# EAGLE design Mainsnode_v2_openmote (EAGLE 6.3)
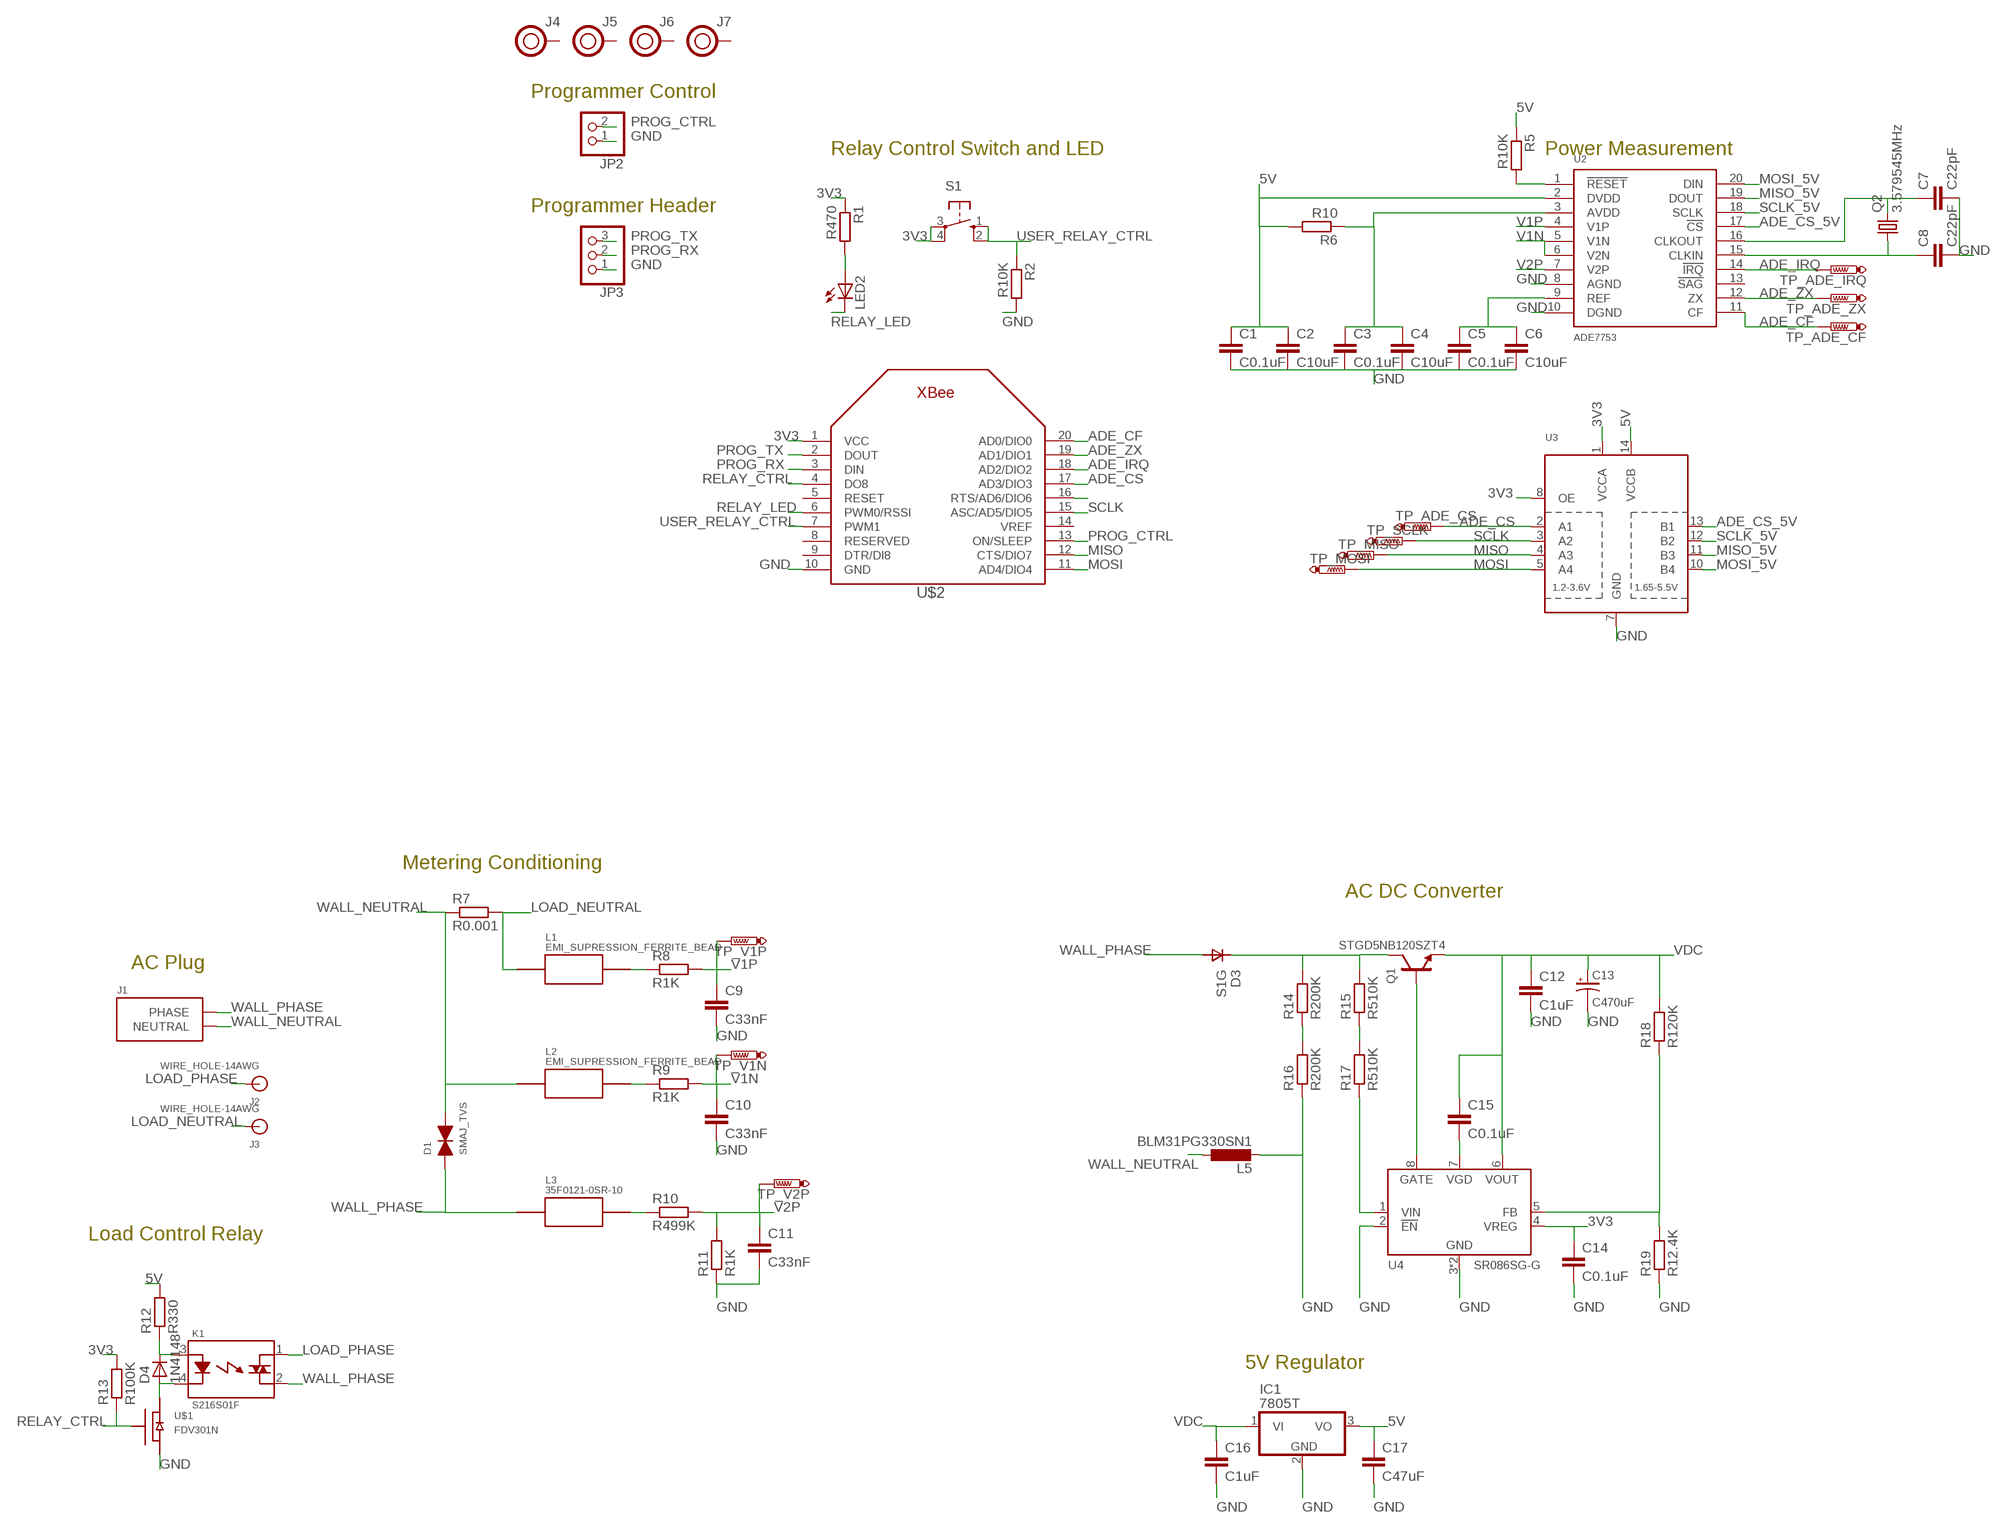
[diagram p0: schematic, sheet 1]

## Parts
C1  C0.1uF  C-EUC0805  [C0805]
C2  C10uF  C-EUC0805  [C0805]
C3  C0.1uF  C-EUC0805  [C0805]
C4  C10uF  C-EUC0805  [C0805]
C5  C0.1uF  C-EUC0805  [C0805]
C6  C10uF  C-EUC0805  [C0805]
C7  C22pF  C-EUC0805  [C0805]
C8  C22pF  C-EUC0805  [C0805]
C9  C33nF  C-EUC0805  [C0805]
C10  C33nF  C-EUC0805  [C0805]
C11  C33nF  C-EUC0805  [C0805]
C12  C1uF  C-EUC0805  [C0805]
C13  C470uF  CAP_EEE-FP1E471AP  [CAP_SM_10MM]
C14  C0.1uF  C-EUC0805  [C0805]
C15  C0.1uF  C-EUC0805  [C0805]
C16  C1uF  C-EUC0805  [C0805]
C17  C47uF  C-EUC0805  [C0805]
D1  SMAJ_TVS  [DO214_TVS]
D3  S1G  [DO-214AC]
D4  1N4148  D-SOD-80  [SOD80]
IC1  7805T  [TO220H]
J1  AC-PLUG-2  [AC_MALE_PINS_2]
J2  WIRE_HOLE-14AWG  [WIRE_HOLE-14AWG]
J3  WIRE_HOLE-14AWG  [WIRE_HOLE-14AWG]
J4  HOLE  [HOLE-0.125]
J5  HOLE  [HOLE-0.125]
J6  HOLE  [HOLE-0.125]
J7  HOLE  [HOLE-0.125]
JP2  PINHD-1X2  [1X02]
JP3  PINHD-1X3  [1X03]
K1  S216S01F  [RELAY_SX16S0X]
L1  EMI_SUPRESSION_FERRITE_BEAD  [L1806]
L2  EMI_SUPRESSION_FERRITE_BEAD  [L1806]
L3  35F0121-0SR-10  [35F0102]
L5  BLM31PG330SN1  L-EUL3216C  [L3216C]
LED2  LED3MM  [LED3MM]
Q1  STGD5NB120SZT4  [DPAK]
Q2  3.579545MHz  CRYSTALHC49S  [HC49/S]
R1  R470  R-EU_R0805  [R0805]
R2  R10K  R-EU_R0805  [R0805]
R5  R10K  R-EU_R0805  [R0805]
R6  R10  R-EU_R0805  [R0805]
R7  R0.001  R-EU_R2512  [R2512]
R8  R1K  R-EU_R0805  [R0805]
R9  R1K  R-EU_R0805  [R0805]
R10  R499K  R-EU_R0805  [R0805]
R11  R1K  R-EU_R0805  [R0805]
R12  R330  R-EU_R0805  [R0805]
R13  R100K  R-EU_R0805  [R0805]
R14  R200K  R-EU_R0805  [R0805]
R15  R510K  R-EU_R0805  [R0805]
R16  R200K  R-EU_R0805  [R0805]
R17  R510K  R-EU_R0805  [R0805]
R18  R120K  R-EU_R0805  [R0805]
R19  R12.4K  R-EU_R0805  [R0805]
S1  10-XX  [B3F-10XX]
TP_ADE_CF  PTR1PAD1-13  [P1-13]
TP_ADE_CS  PTR1PAD1-13  [P1-13]
TP_ADE_IRQ  PTR1PAD1-13  [P1-13]
TP_ADE_ZX  PTR1PAD1-13  [P1-13]
TP_MISO  PTR1PAD1-13  [P1-13]
TP_MOSI  PTR1PAD1-13  [P1-13]
TP_SCLK  PTR1PAD1-13  [P1-13]
TP_V1N  PTR1PAD1-13  [P1-13]
TP_V1P  PTR1PAD1-13  [P1-13]
TP_V2P  PTR1PAD1-13  [P1-13]
U2  ADE7753  [SSOP-20]
U3  TXB0104PWR  [TSSOP14]
U4  SR086SG-G  [SR086]
U$1  FDV301N  [SOT-23]
U$2  XBEE  [XBEE]

## Nets
3V3: C14.1 R1.1 R13.2 S1.3(P) S1.4(P1) U3.1(VCCA) U3.8(OE) U4.4(VREG) U$2.1(VCC)
5V: C1.1 C2.1 C17.1 IC1.3(VO) R5.1 R6.2 R12.2 U2.2(DVDD) U3.14(VCCB)
ADE_CF: TP_ADE_CF.TP U2.11(CF) U$2.20(AD0/DIO0)
ADE_CS: TP_ADE_CS.TP U3.2(A1) U$2.17(AD3/DIO3)
ADE_CS_5V: U2.17(!CS) U3.13(B1)
ADE_IRQ: TP_ADE_IRQ.TP U2.14(!IRQ) U$2.18(AD2/DIO2)
ADE_ZX: TP_ADE_ZX.TP U2.12(ZX) U$2.19(AD1/DIO1)
GND: C1.2 C2.2 C3.2 C4.2 C5.2 C6.2 C7.2 C8.2 C9.2 C10.2 C11.2 C12.2 C13.- C14.2 C16.2 C17.2 IC1.2(GND) JP2.1 JP3.1 L5.2 R2.2 R11.1 R16.1 R19.1 U2.8(AGND) U2.10(DGND) U3.7(GND) U4.2(!EN) U4.3(GND) U4.PAD(GND) U$1.2(S) U$2.10(GND)
LOAD_NEUTRAL: J3.P$1 L1.P$1 R7.2
LOAD_PHASE: J2.P$1 K1.1
MISO: TP_MISO.TP U3.4(A3) U$2.12(CTS/DIO7)
MISO_5V: U2.19(DOUT) U3.11(B3)
MOSI: TP_MOSI.TP U3.5(A4) U$2.11(AD4/DIO4)
MOSI_5V: U2.20(DIN) U3.10(B4)
N$1: D4.1(C) K1.3 R12.1
N$2: LED2.A R1.2
N$3: D4.2(A) K1.4 U$1.3(D)
N$4: R5.2 U2.1(!RESET)
N$5: C3.1 C4.1 R6.1 U2.3(AVDD)
N$7: L1.P$2 R8.1
N$8: L2.P$2 R9.1
N$9: L3.2 R10.1
N$10: C5.1 C6.1 U2.9(REF)
N$13: D3.CATHODE Q1.P$2(C) R14.2 R15.2
N$14: R14.1 R16.2
N$15: R15.1 R17.2
N$17: R17.1 U4.1(VIN)
N$18: Q1.P$1(G) U4.8(GATE)
N$19: C7.1 Q2.2 U2.16(CLKOUT)
N$20: C8.1 Q2.1 U2.15(CLKIN)
N$21: C15.2 U4.7(VGD)
N$23: R18.1 R19.2 U4.5(FB)
N$26: U$2.16(RTS/AD6/DIO6)
PROG_CTRL: JP2.2 U$2.13(ON/SLEEP)
PROG_RX: JP3.2 U$2.3(DIN)
PROG_TX: JP3.3 U$2.2(DOUT)
RELAY_CTRL: R13.1 U$1.1(G) U$2.4(DO8)
RELAY_LED: LED2.K(C) U$2.6(PWM0/RSSI)
SCLK: TP_SCLK.TP U3.3(A2) U$2.15(ASC/AD5/DIO5)
SCLK_5V: U2.18(SCLK) U3.12(B2)
USER_RELAY_CTRL: R2.1 S1.1(S) S1.2(S1) U$2.7(PWM1)
V1N: C10.1 R9.2 TP_V1N.TP U2.5(V1N) U2.6(V2N)
V1P: C9.1 R8.2 TP_V1P.TP U2.4(V1P)
V2P: C11.1 R10.2 R11.2 TP_V2P.TP U2.7(V2P)
VDC: C12.1 C13.+ C15.1 C16.1 IC1.1(VI) Q1.P$3(E) R18.2 U4.6(VOUT)
WALL_NEUTRAL: D1.CATHODE J1.NEUTRAL1(NEUTRAL) J1.NEUTRAL2(NEUTRAL) L2.P$1 L5.1 R7.1
WALL_PHASE: D1.ANODE D3.ANNODE J1.PHASE1(PHASE) J1.PHASE2(PHASE) K1.2 L3.1
Unconnected: J4.1 J5.1 J6.1 J7.1 U2.13(!SAG) U$2.5(RESET) U$2.8(RESERVED) U$2.9(DTR/DI8) U$2.14(VREF)

## Notes on the sheet
- Programmer Control
- Relay Control Switch and LED | Power Measurement
- Programmer Header
- Metering Conditioning
- AC DC Converter
- AC Plug
- Load Control Relay
- 5V Regulator

## Library data of the parts
C1-C12 C14-C17 = resistor:C-EU: CAPACITOR, European symbol
C13 = powercube:CAP_EEE-FP1E471AP: Surface mount low ESR cap.; DIGIKEY: PCE4440CT-ND
D1 = powercube:SMAJ_TVS; DIGIKEY: SMAJ250CALFCT-ND
D3 = powercube:S1G: Diode 400V 1A SMA; DIGIKEY: S1GFSCT-ND
D4 = semicon-smd-ipc:D-: DIODE unfilled
IC1 = adafruit:78*: Positive VOLTAGE REGULATOR Added bigger pads to the TO-92 package
J1 = powercube:AC-PLUG-2: For use with Bud Industries Box: 377-1709-ND
J2 J3 = powercube:WIRE_HOLE-14AWG: Solder point for 14AWG wire
J4-J7 = powercube:HOLE: 0.125" PCB Hole with ring
JP2 = pinhead:PINHD-1X2: PIN HEADER
JP3 = pinhead:PINHD-1X3: PIN HEADER
K1 = powercube:S216S01F: RELAY SSR 240VAC 16A TRIAC 4-SIP; DIGIKEY: 425-2413-5-ND; MOUSER: 852-S216S01F; NEWARK: 14N9591
L1 L2 = powercube:EMI_SUPRESSION_FERRITE_BEAD: FERRITE 300MA 150 OHM 1806 SMD; DIGIKEY: 240-2418-1-ND
L3 = powercube:35F0121-0SR-10: FERRITE 10A 42 OHMS @ 10 MHZ SMD; DIGIKEY: 240-2520-1-ND
L5 = resistor:L-EU: INDUCTOR, European symbol
LED2 = adafruit:LED: LED OSRAM: - CHIPLED LG R971, LG N971, LY N971, LG Q971, LY Q971, LO R971, LY R971 LH N974, LH R974 LS Q976, LO Q976, LY Q976 LO Q996 - Hyper CHIPLED LW Q18S LB Q993, LB Q99A, LB R99A - SideLED LS A670, LO A670, LY A670, LG A670, LP A670 LB A673, LV A673, LT A673, LW A673 LH A674 LY A675 LS A676, LA A676, LO A676, LY A676, LW A676 LS A679, LY A679, LG A679 - Hyper Micro SIDELED® LS Y876, LA Y876, LO Y876, LY Y876 LT Y87S - SmartLED LW L88C, LW L88S LB L89C, LB L89S, LG L890 LS L89K, LO L89K, LY L89K LS L896, LA L896, LO L896, LY L896 - TOPLED LS T670, LO T670, LY T670, LG T670, LP T670 LSG T670, LSP T670, LSY T670, LOP T670, LYG T670 LG T671, LOG T671, LSG T671 LB T673, LV T673, LT T673, LW T673 LH T674 LS T676, LA T676, LO T676, LY T676, LB T676, LH T676, LSB T676, LW T676 LB T67C, LV T67C, LT T67C, LS T67K, LO T67K, LY T67K, LW E67C LS E67B, LA E67B, LO E67B, LY E67B, LB E67C, LV E67C, LT E67C LW T67C LS T679, LY T679, LG T679 LS T770, LO T770, LY T770, LG T770, LP T770 LB T773, LV T773, LT T773, LW T773 LH T774 LS E675, LA E675, LY E675, LS T675 LS T776, LA T776, LO T776, LY T776, LB T776 LHGB T686 LT T68C, LB T68C - Hyper Mini TOPLED® LB M676 - Mini TOPLED Santana® LG M470 LS M47K, LO M47K, LY M47K Source: http://www.osram.convergy.de/
Q1 = powercube:STGD5NB120SZ: 5 A - 1200 V - low drop internally clamped IGBT; DIGIKEY: 497-4352-1-ND
Q2 = crystal:CRYSTAL: CRYSTAL; OC_FARNELL: 1667008; OC_NEWARK: unknown
R1 R2 R5-R19 = resistor:R-EU_: RESISTOR, European symbol
S1 = switch-omron:10-XX: OMRON SWITCH; MPN: B3F-1000; OC_FARNELL: 176432; OC_NEWARK: 36M3542
TP_ADE_CF TP_ADE_CS TP_ADE_IRQ TP_ADE_ZX TP_MISO TP_MOSI TP_SCLK TP_V1N TP_V1P TP_V2P = testpad:PTR1: TEST PIN
U2 = powercube:ADE7753: Single-Phase Multifunction Metering IC; DIGIKEY: ADE7753ARSZRLCT-ND; MOUSER: 584-ADE7753ARSZR; NEWARK: 59K0984
U3 = adafruit:TXB0104PWR: 4-Bit Bi-Directional Level Shifter 1.2V-3.6V (VCCA) to 1.65V-5.5V (VCCB) bi-directional level shifter with auto direction sensing. Max data rate - VCCA 1.8V: 20Mbps (50ns), VCCA 3.3V: 100Mbps (10ns) Digikey: 296-21929-1-ND
U4 = powercube:SR086: Adjustable Off-Line Inductorless Switching Regulator; MOUSER: 689-SR086SG-G
U$1 = powercube:FDV301N; DIGIKEY: FDV301NCT-ND
U$2 = adafruit:XBEE

## Board
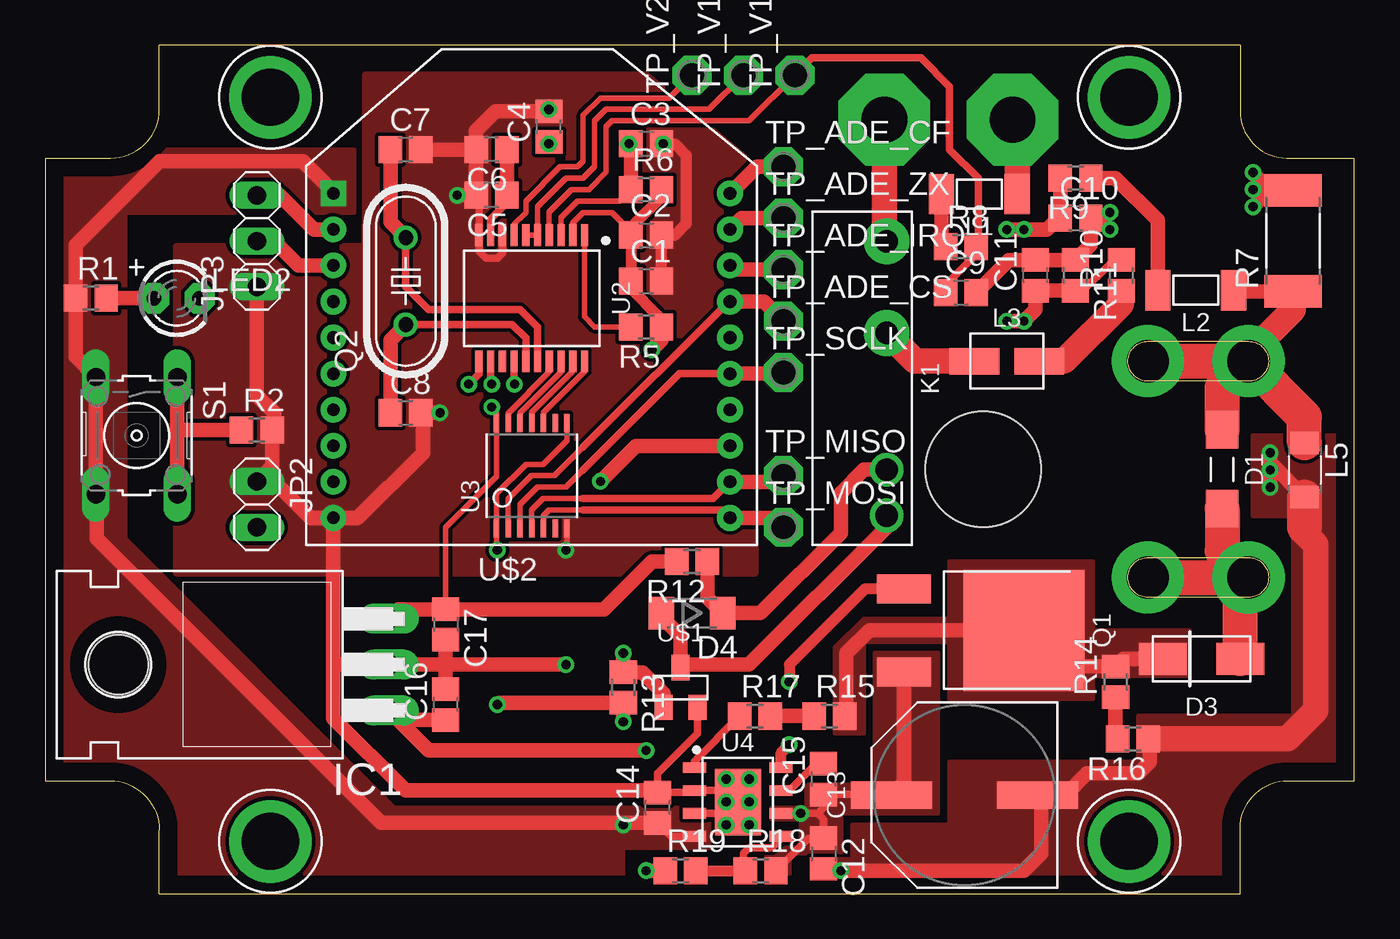
[diagram p1: board, top side]
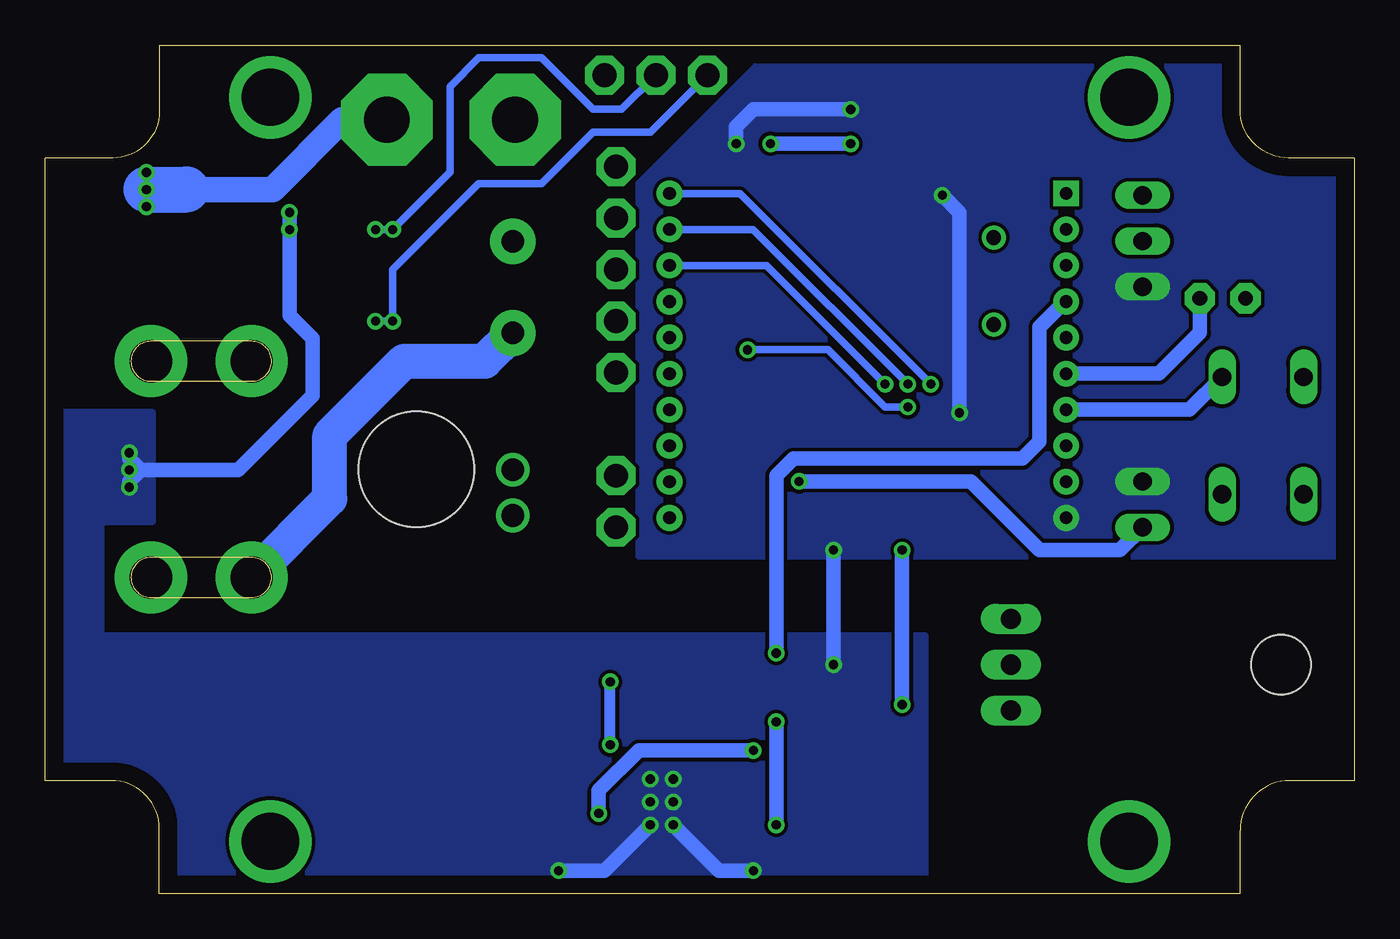
[diagram p2: board, bottom side, seen from below]

Size 72.62 x 47.07 mm. Coordinates in mm from the lower left corner, seen from the top.
Outline: 6.34,0 66.28,0 66.28,3.6 arc-90 68.94,6.26 72.62,6.26 72.62,40.8 68.87,40.8 arc-90 66.28,43.39 66.28,47.07 6.34,47.07 6.34,43.49 arc-90 3.65,40.8 0,40.8 0,6.26 3.58,6.26 arc-90 6.34,3.51 6.34,0
Copper layers (1*16): Top 0.035mm / dielectric 1.5mm / Bottom 0.035mm
Design rules "default": minimum track width 10mil, minimum drill 24mil, track to track 8mil, track to pad 8mil, pad to pad 8mil, via to via 8mil, smd to smd 8mil, copper to edge 40mil, drill to drill 8mil, minimum pad ring 10mil, minimum via ring 8mil, stop-mask expansion 4mil, vias tented up to drill 0mil, thermal gap 10mil

### Footprints (pad centres in the part's own frame; a part is rotated, then mirrored left to right if it is on the bottom)
C0805 = smd 1.3 x 1.5: 1 -0.85,0; 2 0.85,0
CAP_SM_10MM = smd 1.5 x 4.5: + 0,4.05; - 0,-4.05
DO214_TVS = smd 2.083 x 1.778: ANODE 2.184,0; CATHODE -2.184,0
DO-214AC = smd 2.65 x 1.75: ANNODE -2.15,0; CATHODE 2.15,0
SOD80 = smd 1.4 x 1.8: 1 -1.7,0; 2 1.7,0
TO220H = drill 1.118 long: 1 -2.54,-10.16; 2 0,-10.16; 3 2.54,-10.16 | hole 3.302: 0,4.826
AC_MALE_PINS_2 = drill 2.34 pad 4: NEUTRAL1 -2.79,-5.995; NEUTRAL2 2.79,-5.995; PHASE1 -2.79,5.995; PHASE2 2.79,5.995 | hole 6.426: 11.938,0
WIRE_HOLE-14AWG = drill 2.54 pad 5.08 octagon: P$1 0,0
HOLE-0.125 = drill 3.175 pad 4.572: 1 0,0
1X02 = drill 1.016 long: 1 -1.27,0; 2 1.27,0
1X03 = drill 1.016 long: 1 -2.54,0; 2 0,0; 3 2.54,0
RELAY_SX16S0X = drill 1.25 pad 2.54: 1 -7.602,0; 2 -2.522,0 | drill 1.25: 3 5.062,0; 4 7.602,0
L1806 = smd 1.4 x 2.24: P$1 -2.1,0; P$2 2.1,0
35F0102 = smd 2.769 x 1.473: 1 -1.791,0; 2 1.791,0
L3216C = smd 1.2 x 1.6: 1 -1.5,0; 2 1.5,0
LED3MM = drill 0.813 pad 1.676 octagon: A -1.27,0; K 1.27,0
DPAK = smd 1.6 x 3: P$1 -2.3,-6.65; P$3 2.3,-6.65 | smd 6.7 x 6.7: P$2 0,0
HC49/S = drill 0.813: 1 -2.413,0; 2 2.413,0
R0805 = smd 1.3 x 1.5: 1 -0.85,0; 2 0.85,0
R2512 = smd 1.8 x 3.2: 1 -2.8,0; 2 2.8,0
B3F-10XX = drill 1.016 long: 1 -3.251,2.261; 2 3.251,2.261; 3 -3.251,-2.261; 4 3.251,-2.261
P1-13 = drill 1.321 pad 2.159 octagon: TP 0,0
SSOP-20 = smd 1.2 x 0.4: 1 -3.5,2.925; 2 -3.5,2.275; 3 -3.5,1.625; 4 -3.5,0.975; 5 -3.5,0.325; 6 -3.5,-0.325; 7 -3.5,-0.975; 8 -3.5,-1.625; 9 -3.5,-2.275; 10 -3.5,-2.925; 11 3.5,-2.925; 12 3.5,-2.275; 13 3.5,-1.625; 14 3.5,-0.975; 15 3.5,-0.325; 16 3.5,0.325; 17 3.5,0.975; 18 3.5,1.625; 19 3.5,2.275; 20 3.5,2.925
TSSOP14 = smd 0.305 x 0.991: 1 -1.95,-2.918; 2 -1.3,-2.918; 3 -0.65,-2.918; 4 0,-2.918; 5 0.65,-2.918; 6 1.3,-2.918; 7 1.95,-2.918; 8 1.95,2.918; 9 1.3,2.918; 10 0.65,2.918; 11 0,2.918; 12 -0.65,2.918; 13 -1.3,2.918; 14 -1.95,2.918
SR086 = smd 1.27 x 0.6: 1 -2.4,1.905; 2 -2.4,0.635; 3 -2.4,-0.635; 4 -2.4,-1.905; 5 2.4,-1.905; 6 2.4,-0.635; 7 2.4,0.635; 8 2.4,1.905 | smd 2.55 x 3.7: PAD 0,0
SOT-23 = smd 1 x 1.4: 1 -0.95,-1.1; 2 0.95,-1.1; 3 0,1.1
XBEE = drill 0.7 pad 1.422 square: 1 -11,5.5 | drill 0.7 pad 1.422: 2 -11,3.5; 3 -11,1.5; 4 -11,-0.5; 5 -11,-2.5; 6 -11,-4.5; 7 -11,-6.5; 8 -11,-8.5; 9 -11,-10.5; 10 -11,-12.5; 11 11,-12.5; 12 11,-10.5; 13 11,-8.5; 14 11,-6.5; 15 11,-4.5; 16 11,-2.5; 17 11,-0.5; 18 11,1.5; 19 11,3.5; 20 11,5.5

### Placement (x,y rotation side)
C1  33.34,33.97 0 top
C2  33.34,36.51 0 top
C3  33.34,41.59 0 top
C4  27.94,42.55 90 top
C5  24.77,38.73 180 top
C6  24.77,41.27 180 top
C7  20,41.27 0 top
C8  20,26.67 0 top
C9  50.8,33.34 0 top
C10  57.15,37.47 0 top
C11  54.93,34.29 90 top
C12  43.18,2.22 270 top
C13  50.99,5.46 90 top
C14  33.97,4.76 90 top
C15  43.18,6.35 90 top
C16  22.23,10.48 90 top
C17  22.23,14.92 270 top
D1  65.28,23.53 270 top
D3  64.14,13.02 180 top
D4  35.88,15.56 180 top
IC1  8.89,12.7 90 top
J1  63.96,23.53 180 top
J2  46.55,42.93 0 top
J3  53.66,42.93 0 top
J4  12.5,2.9 0 top
J5  60.12,2.9 0 top
J6  60.12,44.17 0 top
J7  12.5,44.17 0 top
JP2  11.75,21.59 270 top
JP3  11.75,36.2 90 top
K1  46.67,28.57 270 top
L1  51.82,38.8 180 top
L2  63.82,33.46 180 top
L3  53.34,29.53 0 top
L5  69.85,23.5 270 top
LED2  7.3,33.02 0 top
Q1  54.29,14.61 270 top
Q2  20,33.97 90 top
R1  2.54,33.02 0 top
R2  11.75,25.72 0 top
R5  33.34,31.43 180 top
R6  33.34,39.05 0 top
R7  69.22,36.2 90 top
R8  50.8,35.88 0 top
R9  57.15,39.69 180 top
R10  59.69,34.29 90 top
R11  57.15,34.29 270 top
R12  35.88,18.41 180 top
R13  32.07,11.43 270 top
R14  59.37,11.75 90 top
R15  43.5,9.84 0 top
R16  60.33,8.57 180 top
R17  39.37,9.84 0 top
R18  39.69,1.27 0 top
R19  35.24,1.27 0 top
S1  5.08,25.4 270 top
TP_ADE_CF  40.96,40.32 0 top
TP_ADE_CS  40.96,31.75 0 top
TP_ADE_IRQ  40.96,34.61 0 top
TP_ADE_ZX  40.96,37.47 0 top
TP_MISO  40.96,23.18 0 top
TP_MOSI  40.96,20.32 0 top
TP_SCLK  40.96,28.89 0 top
TP_V1N  38.73,45.4 90 top
TP_V1P  41.59,45.4 90 top
TP_V2P  35.88,45.4 90 top
U2  26.99,33.02 270 top
U3  26.99,23.18 0 top
U4  38.42,5.08 0 top
U$1  35.24,11.43 0 top
U$2  26.99,33.34 0 top

### Tracks (layer width: path | path; a pad name or v marks a point on that pad's centre or on a via)
3V3  (via drill 0.51)
  Top 0.305: U3.8 28.94,25.13 27.62,23.81 26.67,23.81 25.04,22.18 U3.1 25.04,19.09 v25.08,19.05
  Top 0.406: U4.4 34.71,3.17 C14.1
  Top 0.813: U$2.1 15.99,38.94 14.29,40.64 6.35,40.64 1.69,35.98 R1.1 1.69,29.78 S1.3 S1.4 2.86,22.11 2.86,19.68 18.63,3.91 31.96,3.91 v32.07,3.81 32.17,3.91 C14.1 | v32.07,9.53 R13.2 25.18,10.58 v25.08,10.48
  Bottom 0.813: v32.07,3.81 v32.07,9.53 | v25.08,19.05 v25.08,10.48
  pour Top (no thermals): 36.83,4.76 36.83,2.54 32.07,2.54 32.07,0 0,0 0,41.27 17.14,41.27 17.14,37.78 4.45,37.78 4.45,19.68 19.37,4.76
5V  (via drill 0.51)
  Top 0.305: U2.2 29.26,37.2 29.84,37.78 31.43,37.78 32.07,37.15 32.7,37.15 | C17.1 22.23,20.32 25.04,23.13 U3.14 25.04,26.71 v24.77,26.99
  Top 0.61: R6.2 34.19,38.63 32.7,37.15 32.7,36.73 C2.1 C1.1 32.49,33.55 33.97,32.07 33.97,31.65 R5.1
  Top 0.813: IC1.3 19.58,15.77 C17.1 31.01,15.77 33.66,18.41 R12.2 | R5.1 34.19,30.7 v33.66,30.16
  Bottom 0.406: v24.77,26.99 26.04,26.99 29.21,30.16 v33.66,30.16
ADE_CF  (via drill 0.51)
  Top 0.406: U2.11 24.06,28.82 v23.5,28.26
  Top 0.813: TP_ADE_CF.TP 39.47,40.32 U$2.20
  Bottom 0.406: U$2.20 34.08,38.84 v23.5,28.26
ADE_CS
  Top 0.305: U3.2 25.69,21.88 26.99,23.18 28.26,23.18 29.84,24.77
  Top 0.406: U$2.17 37.92,32.84 29.84,24.77
  Top 0.813: U$2.17 39.87,32.84 TP_ADE_CS.TP
ADE_CS_5V
  Top 0.305: U2.17 27.96,28.91 25.69,26.64 U3.13
ADE_IRQ  (via drill 0.51)
  Top 0.406: U2.14 26.01,28.28 v26.04,28.26
  Top 0.813: TP_ADE_IRQ.TP 38.22,34.61 U$2.18
  Bottom 0.406: U$2.18 32.62,34.84 v26.04,28.26
ADE_ZX  (via drill 0.51)
  Top 0.406: U2.12 24.71,28.31 v24.77,28.26
  Top 0.813: TP_ADE_ZX.TP 38.62,37.47 U$2.19
  Bottom 0.406: U$2.19 33.34,36.84 v24.77,28.26
GND  (via drill 0.51)
  Top 0.305: U3.7 28.94,19.09 v28.89,19.05 | v27.94,43.5 C4.2
  Top 0.406: U4.3 37.78,4.45 | 37.94,4.6 U4.PAD 37.78,5.71 U4.2 35.91,5.61 C14.2 33.97,6.67 36.2,8.89 U$1.2 36.19,10.16 | C5.2 24.06,38.59 U2.10 24.06,35.63 24.45,35.24 25.08,35.24 25.36,35.52 U2.8
  Top 0.61: C1.2 C2.2 34.92,36.51 35.56,37.15 35.56,40.96 34.92,41.59 v34.29,41.59 C3.2
  Top 0.813: 61.59,8.57 R16.1 61.28,8.47 61.28,7.3 60.64,6.67 57.78,6.67 56.58,5.46 C13.- 55.24,5.26 55.24,2.22 54.29,1.27 v44.13,1.27 43.28,1.27 C12.2 | R19.1 v33.34,1.27 | 37.94,4.6 37.78,4.45 v37.78,3.81 v39.05,3.81 | v39.05,6.35 v37.78,6.35 v37.78,5.08 U4.PAD v39.05,5.08 | C14.2 33.87,5.71 20,5.71 15.99,9.73 15.99,12.7 | JP3.1 11.75,27.62 12.7,26.67 12.7,25.82 R2.2 12.6,23.71 12.22,23.34 | 12.22,23.34 JP2.1 | U$2.10 14.72,20.84 12.22,23.34 | C7.2 C6.2 | C6.2 C5.2 v22.86,38.73 | C6.2 23.91,42.33 24.98,43.4 C4.2 | U$2.10 15.99,12.7 | 15.99,12.7 IC1.2 22.23,12.7 | U$2.10 17.34,20.84 20.95,24.45 20.95,26.57 C8.2 v21.91,26.67 | C17.2 22.23,12.7 | C16.2 22.23,12.7 | v28.89,12.7 22.23,12.7 | C9.2 53.45,35.14 C11.2 R11.1 58,35.99 C10.2 58.42,37.47 58.58,37.31 | 58.58,37.31 v59.05,36.83 | v59.05,37.78 58.58,37.31 | v67.94,23.5 v67.94,22.54 | v67.94,24.45 67.94,23.9 L5.2
  Top 1.422: 69.85,20.32 69.85,20 70.48,19.37 70.48,10.16 68.9,8.57 61.59,8.57
  Top 1.93: L5.2 69.85,20.32
  Bottom 0.813: v33.34,1.27 35.24,1.27 v37.78,3.81 | v44.13,1.27 41.59,1.27 v39.05,3.81 | v28.89,19.05 v28.89,12.7 | v59.05,37.78 59.05,32.07 57.78,30.8 57.78,27.62 61.91,23.5 v67.94,23.5 67.31,23.5 | 67.31,23.5 67.94,24.13 v67.94,24.45 | 67.31,23.5 67.94,22.86 v67.94,22.54 | v27.94,43.5 33.34,43.5 34.29,42.55 v34.29,41.59 | v21.91,26.67 21.91,37.78 v22.86,38.73
  pour Top (no thermals): 42.55,1.91 42.55,0 72.71,0 72.71,25.4 66.99,25.4 66.99,20.95 69.22,20.95 69.22,9.84 60.64,9.84 60.64,7.3 50.16,7.3 50.16,3.81 44.77,3.81 44.77,1.91
  pour Top (no thermals): 17.78,45.4 17.78,35.88 7.3,35.88 7.3,17.78 39.37,17.78 39.37,40.32 33.34,45.4
  pour Bottom (no thermals): 72.71,26.67 66.67,26.67 66.67,20.64 69.53,20.64 69.53,14.29 23.81,14.29 23.81,0 72.71,0
  pour Bottom (no thermals): 39.37,18.73 0,18.73 0,46.99 32.07,46.99 39.37,39.69 39.69,39.37 39.69,18.73
LOAD_NEUTRAL  (via drill 0.51)
  Top 0.813: R7.2 67.94,38.99 | 67.94,38.99 67.63,38.99 | 67.63,38.99 67.05,38.99 v66.99,39.05 | v66.99,40.01 66.99,39.95 67.94,38.99 | v66.99,38.1 67.63,38.73 67.63,38.99
  Top 1.422: L1.P$1 53.92,42.67 J3.P$1
  Bottom 1.422: J3.P$1 56.13,42.93 60.01,39.05 64.77,39.05
  Bottom 2.54: v66.99,39.05 64.77,39.05
LOAD_PHASE
  Top 1.422: J2.P$1 46.55,36.3 K1.1
MISO
  Top 0.305: U3.4 26.99,21.27 27.62,21.91 29.84,21.91
  Top 0.406: 29.84,21.91 37.06,21.91 U$2.12
  Top 0.813: U$2.12 40.62,22.84 TP_MISO.TP
MISO_5V
  Top 0.305: U2.19 29.26,28.95 26.99,26.67 U3.11
MOSI
  Top 0.305: U3.5 27.64,20.97 27.94,21.27 29.84,21.27
  Top 0.406: 29.84,21.27 37.55,21.27 U$2.11
  Top 0.813: U$2.11 40.44,20.84 TP_MOSI.TP
MOSI_5V
  Top 0.305: U2.20 29.91,28.96 27.64,26.68 U3.10
N$1
  Top 0.813: R12.1 36.73,16.41 D4.1 39.69,15.56 44.13,20 44.13,22.23 45.42,23.51 K1.3
N$2
  Top 0.813: R1.2 LED2.A
N$3
  Top 0.813: D4.2 34.18,15.35 35.24,14.29 U$1.3 35.41,12.7 39.05,12.7 46.67,20.32 K1.4
N$4
  Top 0.305: U2.1 29.91,32 30.48,31.43 R5.2
N$5  (via drill 0.51)
  Top 0.305: U2.3 28.61,37.5 29.53,38.42 31.85,38.42 R6.1
  Top 0.813: R6.1 C3.1 v32.38,41.59 | v27.94,41.59 C4.1
  Bottom 0.813: v27.94,41.59 v32.38,41.59
N$7
  Top 0.813: L1.P$2 49.72,36.11 R8.1
N$8
  Top 0.813: R9.1 59.37,39.69 61.72,37.34 L2.P$2
N$9
  Top 0.813: 59.69,32.7 R10.1
  Top 1.422: L3.2 56.52,29.53 59.69,32.7
N$10
  Top 0.406: C5.1 25.61,38.31 24.71,37.41 U2.9
  Top 0.813: C6.1 C5.1
N$13
  Top 0.813: D3.CATHODE 59.79,13.02 R14.2 56.3,12.6 Q1.P$2 45.72,14.61 44.45,13.34 44.45,9.95 R15.2
  pour Top (no thermals): 63.5,14.61 63.5,12.06 58.1,12.06 58.1,10.79 50.16,10.79 50.16,13.97 45.4,13.97 45.4,8.89 43.81,8.89 43.81,13.65 45.4,15.24 50.16,15.24 50.16,18.41 58.1,18.41 58.1,14.61
N$14
  Top 0.813: R14.1 59.37,8.68 R16.2
N$15
  Top 0.813: R17.2 R15.1
N$17
  Top 0.406: U4.1 36.02,7.34 R17.1
N$18  (via drill 0.51)
  Top 0.61: U4.8 40.82,7.8 v41.27,8.26 | Q1.P$1 45.48,16.91 41.27,12.7 v41.27,11.75
  Bottom 0.61: v41.27,8.26 v41.27,11.75
N$19
  Top 0.406: Q2.2 20,33.66 21.27,32.38 26.35,32.38 27.31,31.43 U2.16
  Top 0.813: C7.1 19.15,37.24 Q2.2
N$20
  Top 0.406: U2.15 26.66,30.8 25.91,31.56 Q2.1
  Top 0.813: C8.1 19.15,30.71 Q2.1
N$21
  Top 0.406: U4.7 41.27,5.71 42.55,6.99 42.97,6.99 C15.2
N$23
  Top 0.406: U4.5 40.82,3.04 40.32,2.54 39.05,2.54 38.73,2.22 38.73,1.37 R18.1
  Top 0.61: R19.2 R18.1
PROG_CTRL  (via drill 0.51)
  Top 0.813: U$2.13 32.77,24.84 v30.8,22.86
  Bottom 0.813: JP2.2 13.02,19.05 17.46,19.05 21.27,22.86 v30.8,22.86
PROG_RX
  Top 0.813: U$2.3 14.06,34.84 12.7,36.2 JP3.2
PROG_TX
  Top 0.813: JP3.3 13.02,38.73 14.92,36.83 U$2.2
RELAY_CTRL  (via drill 0.51)
  Top 0.813: U$1.1 34.29,11.11 33.12,12.28 R13.1 v32.07,13.34
  Bottom 0.813: v32.07,13.34 32.07,23.18 31.11,24.13 18.41,24.13 17.46,25.08 17.46,31.43 16.06,32.84 U$2.4
RELAY_LED
  Bottom 0.813: U$2.6 10.85,28.84 8.57,31.11 LED2.K
SCLK
  Top 0.305: U3.3 26.34,21.57 27.3,22.54 28.89,22.54 29.84,23.5
  Top 0.406: U$2.15 35.19,28.84 29.84,23.5
  Top 0.813: U$2.15 40.9,28.84 TP_SCLK.TP
SCLK_5V
  Top 0.305: U2.18 28.61,28.93 26.34,26.66 U3.12
USER_RELAY_CTRL
  Top 0.813: S1.1 7.34,25.72 | 7.34,25.72 S1.2 | R2.1 7.34,25.72
  Bottom 0.813: U$2.7 9.15,26.84 S1.1
V1N  (via drill 0.51)
  Top 0.305: TP_V1N.TP 36.83,43.5 31.11,43.5 30.48,42.86 30.48,40.32 29.84,39.69 28.89,39.69 27.31,38.11 U2.5 U2.6
  Top 0.813: R9.2 C10.1 56.2,37.47 55.56,36.83 v54.29,36.83 v53.34,36.83
  Bottom 0.406: TP_V1N.TP 40.64,43.5 42.23,43.5 45.09,46.35 48.58,46.35 50.16,44.77 50.16,40.01 v53.34,36.83 v54.29,36.83
V1P
  Top 0.305: U2.4 27.96,37.8 29.21,39.05 30.16,39.05 31.11,40.01 31.11,42.55 31.43,42.86 39.05,42.86 TP_V1P.TP
  Top 0.406: TP_V1P.TP 42.55,46.35 48.58,46.35 50.16,44.77 50.16,41.27 51.75,39.69 51.75,35.98 R8.2 | 51.75,36.09 R8.2 | R8.2 51.65,35.46 50.16,33.97 50.16,33.55 C9.1
V2P  (via drill 0.51)
  Top 0.305: U2.7 26.01,37.12 26.67,37.78 26.67,38.42 28.57,40.32 29.53,40.32 29.84,40.64 29.84,43.18 30.8,44.13 34.61,44.13 TP_V2P.TP
  Top 0.406: R11.2 57.57,33.44 59.05,34.92 59.48,34.92 R10.2
  Top 0.813: R11.2 C11.1 54.93,32.38 v54.29,31.75 v53.34,31.75
  Bottom 0.406: TP_V2P.TP 39.05,42.23 42.23,42.23 45.09,39.37 48.58,39.37 53.34,34.61 v53.34,31.75 v54.29,31.75
VDC  (via drill 0.51)
  Top 0.406: R18.2 42.34,3.07 C12.1 43.18,4.13 42.86,4.45 | 42.86,4.45 43.18,4.76 C15.1 46.27,5.5 46.58,5.82 | U4.6 v41.91,4.45 42.86,4.45
  Top 0.813: Q1.P$3 47.64,6.16 C13.+ 46.58,5.82 | C16.1 19.58,9.63 IC1.1 21.27,7.94 v33.34,7.94
  Bottom 0.813: v41.91,4.45 41.91,5.71 39.69,7.94 v33.34,7.94
  pour Top (no thermals): 42.23,4.76 40.32,4.76 40.32,4.13 41.91,4.13 41.91,2.54 40.01,2.54 40.01,0 41.27,0 41.27,2.22 44.13,2.22 44.13,4.45 49.53,4.45 49.53,13.34 46.04,13.34 46.04,6.03 42.23,6.03
WALL_NEUTRAL
  Top 0.813: R7.1 65.99,33.4 L2.P$1
  Top 1.422: J1.NEUTRAL1 66.75,29.92 69.22,32.38 R7.1
  Top 1.93: J1.NEUTRAL2 J1.NEUTRAL1 | D1.CATHODE 65.28,28.06 J1.NEUTRAL1 | L5.1 69.85,26.43 J1.NEUTRAL1
WALL_PHASE
  Top 1.422: L3.1 48.24,29.53 K1.2
  Top 1.93: D1.ANODE 65.28,19.01 J1.PHASE1 | D3.ANNODE 66.28,17.08 J1.PHASE1 | J1.PHASE2 J1.PHASE1
  Bottom 1.93: J1.PHASE2 61.17,17.57 56.83,21.91 56.83,25.4 52.7,29.53 48.24,29.53 K1.2